# EasyEDA schematic PERSONCOUNTERWITHLED.json
TITLE: Sheet_1; REV: 1.0; Date: 2026-04-03; Sheet: 1/1; Company: Your Company
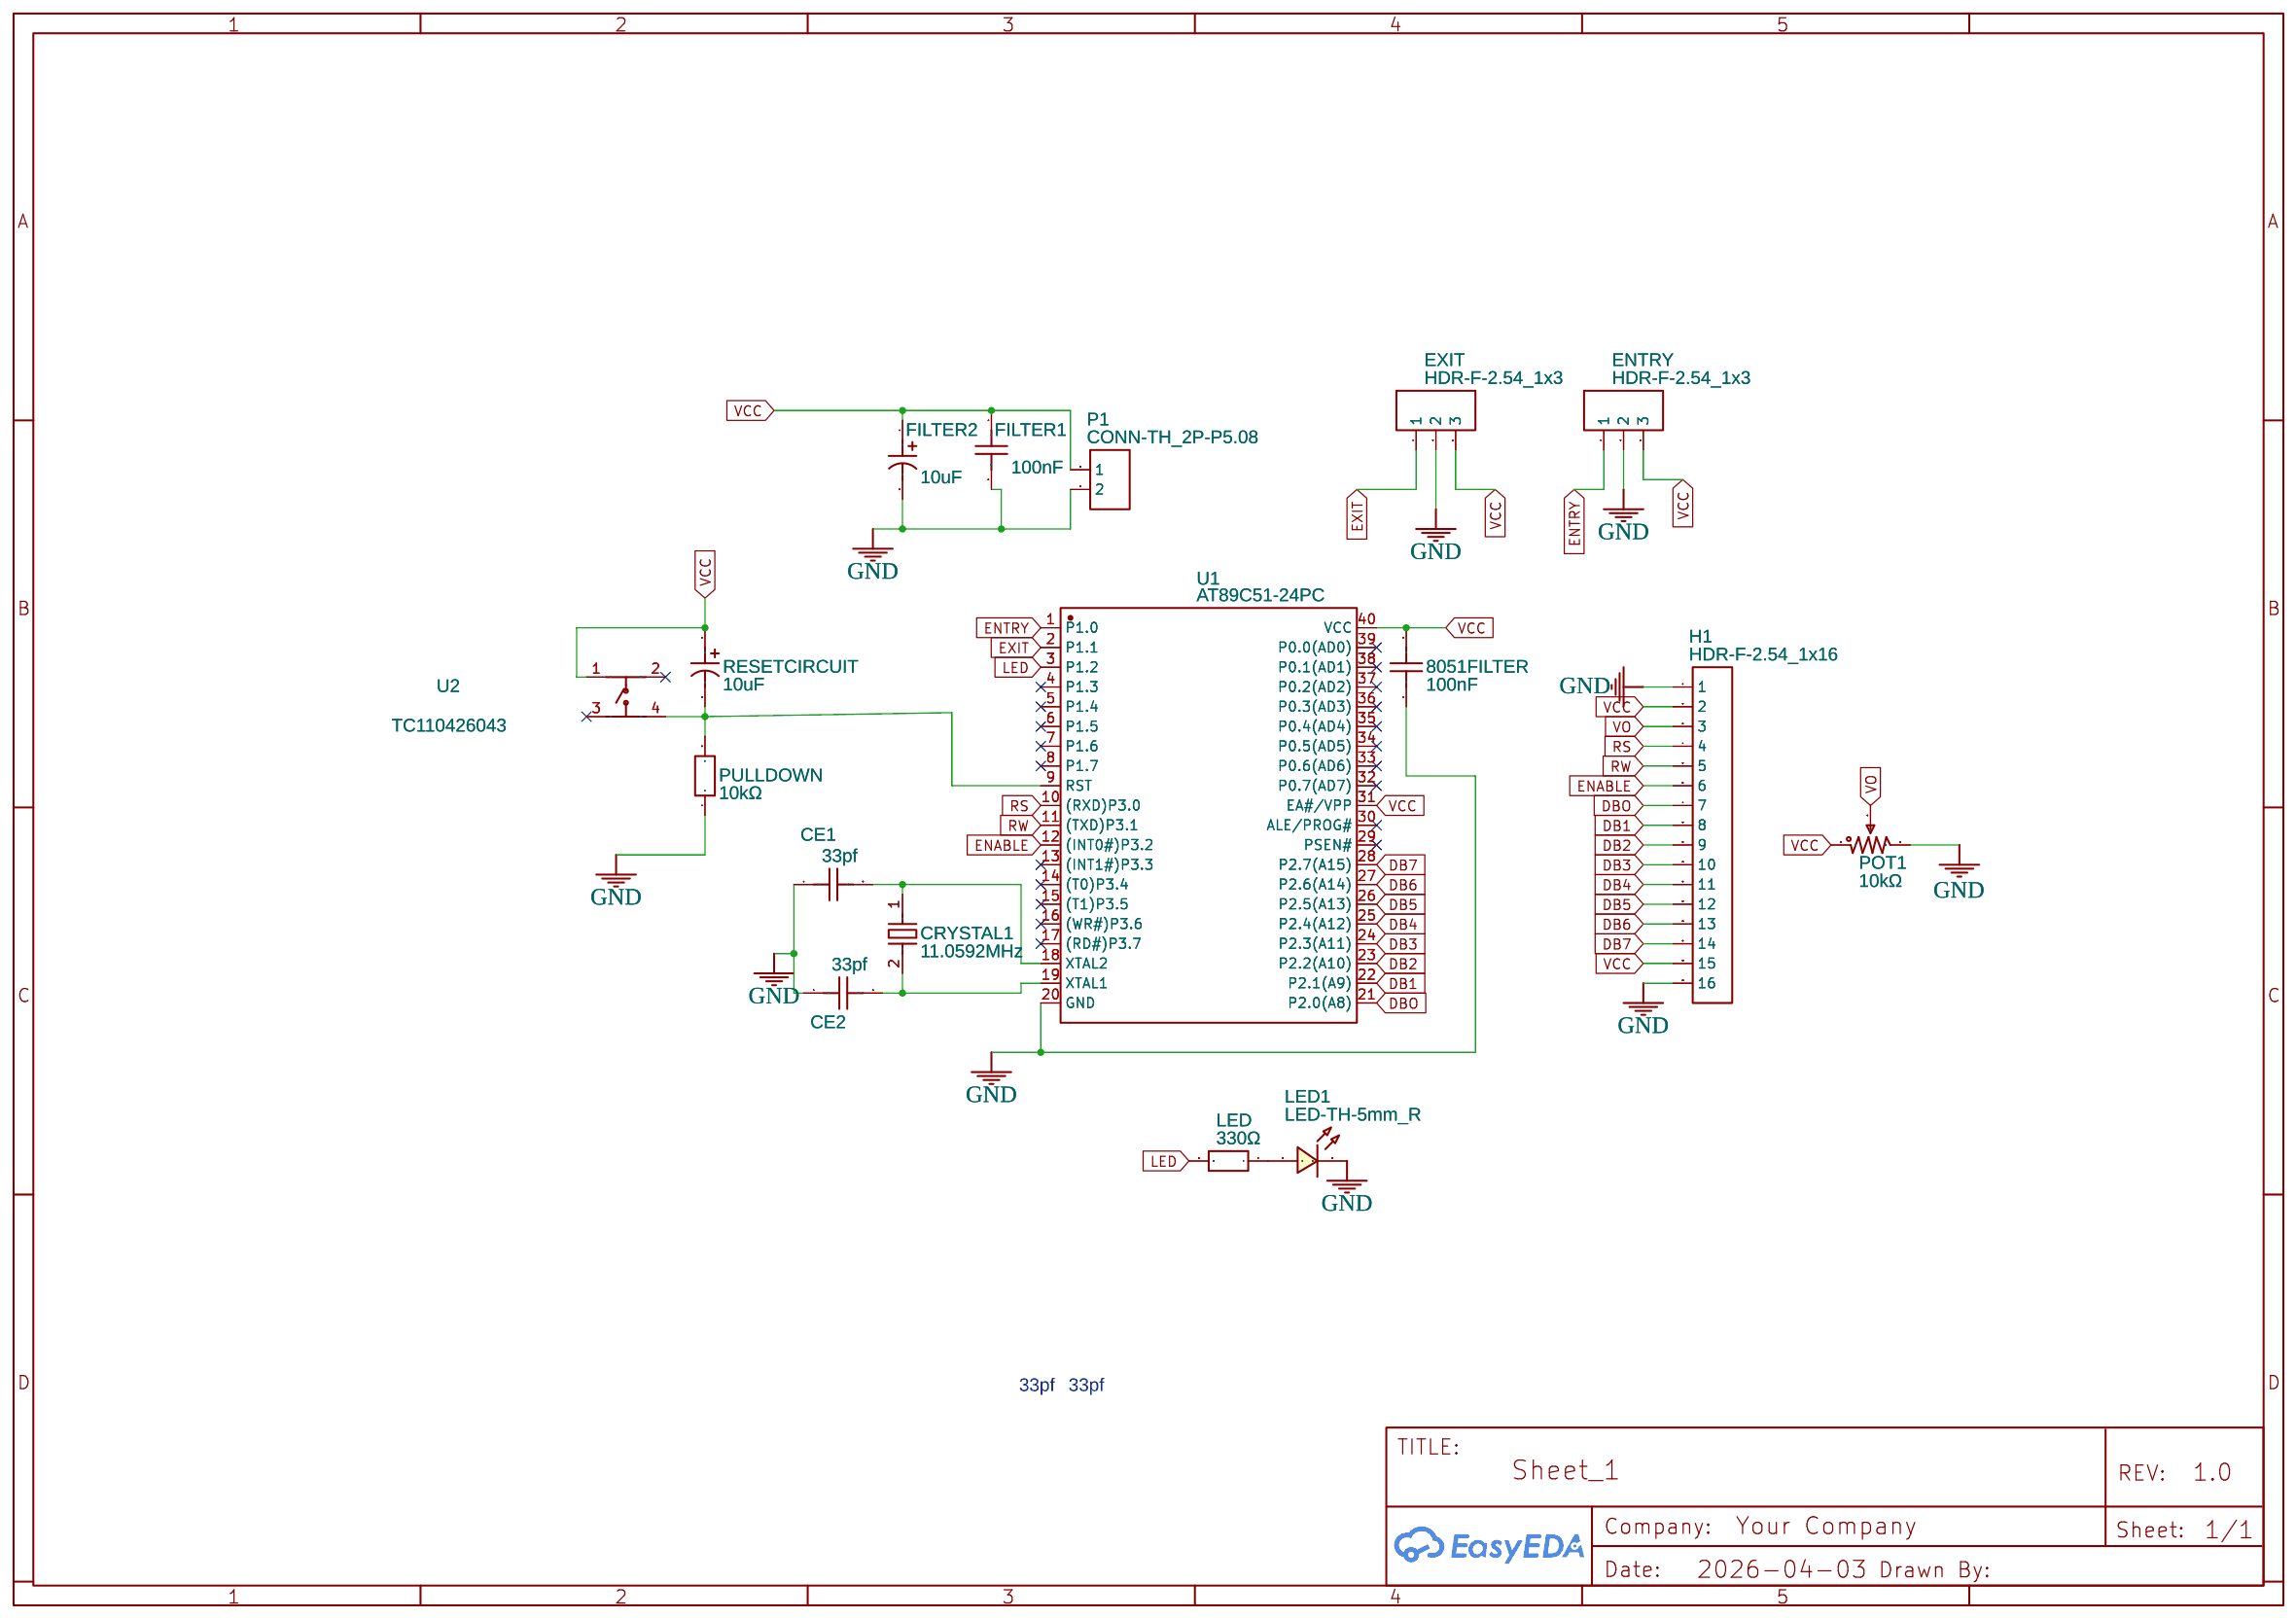
[diagram p0: schematic sheet]

## Parts
8051FILTER  100nF  [CAP-TH_L5.5-W2.0-P5.00-D1.0]
CE1  33pf  [CAP-TH_L5.5-W2.0-P5.00-D1.0]
CE2  33pf  [CAP-TH_L5.5-W2.0-P5.00-D1.0]
CRYSTAL1  11.0592MHz  [CRYSTAL-TH_L10.8-W4.5-P4.88]
ENTRY  HDR-F-2.54_1x3  [HDR-F-2.54_1X3]
EXIT  HDR-F-2.54_1x3  [HDR-F-2.54_1X3]
FILTER1  100nF  [CAP-TH_L5.5-W2.0-P5.00-D1.0]
FILTER2  10uF  [CAP-TH_BD5.0-P2.00-D0.8-FD-10UF50VC110GL]
H1  HDR-F-2.54_1x16  [HDR-F-2.54_1X16]
LED  330Ω  [RES-TH_BD2.2-L6.5-P10.50-D0.6]
LED1  LED-TH-5mm_R  [LED-TH_BD5.0_RED]
P1  CONN-TH_2P-P5.08  [CONN-TH_2P-P5.08]
POT1  10kΩ  [RES-ADJ-SMD_RM065-V1]
PULLDOWN  10kΩ  [RES-TH_BD2.2-L6.5-P10.50-D0.6]
RESETCIRCUIT  10uF  [CAP-TH_BD5.0-P2.00-D0.8-FD-10UF50VC110GL]
U1  AT89C51-24PC  [PDIP-40_L51.8-W13.5-P2.54-LS15.4-BL]
U2  TC110426043  [KEY-TH_4P-L6.0-W6.0-P4..5-LS6.5]

## Library data of the parts
8051FILTER CE1 CE2 FILTER1 = CC1H104ZC1PD3F5P3003: Contributor: LCSC; Supplier: LCSC; Supplier Part: C353904; Manufacturer: Dersonic(德尔创); JLCPCB Part Class: Extended Part
CRYSTAL1 = SP2011M05920001: Supplier: LCSC; Supplier Part: C7294716; Manufacturer: HUAXIN(华昕); Contributor: lcsc
ENTRY EXIT = HDR-F-2.54_1x3: Supplier Part: C146690; Supplier: LCSC; Contributor: LCEDA_Lib
FILTER2 RESETCIRCUIT = 10UF50VC110GL: Supplier: LCSC; Supplier Part: C46867109; Manufacturer: Econd(米朗电子); Contributor: lcsc; JLCPCB Part Class: Extended Part
H1 = HDR-F-2.54_1x16: Supplier Part: C66987; Supplier: LCSC; Contributor: LCEDA_Lib
LED PULLDOWN = MF006FF2202A50: Supplier: LCSC; Supplier Part: C18724236; Manufacturer: UNI-ROYAL(厚声); Contributor: lcsc; JLCPCB Part Class: Extended Part
LED1 = LED-TH-5mm_R: Manufacturer: EVERLIGHT(台湾亿光); Manufacturer Part: 333-2SURD/S530-A3; Supplier Part: C87271; Supplier: LCSC; Contributor: LCEDA_Lib
P1 = CONN-TH_2P-P5.08: Supplier: LCSC; Contributor: LCEDA_Lib
POT1 = RM065-103(10K): Supplier: LCSC; Supplier Part: C5205021; Manufacturer: BOCHEN(博晨); Contributor: lcsc; JLCPCB Part Class: Extended Part
U1 = AT89C51-24PC: Supplier: LCSC; Supplier Part: C6747247; Manufacturer: MICROCHIP(美国微芯); Contributor: lcsc; JLCPCB Part Class: Extended Part
U2 = TC110426043: Supplier: LCSC; Supplier Part: C22375329; Manufacturer: HanElectricity(瀚源); Contributor: lcsc; JLCPCB Part Class: Extended Part

## Nets
GND: 8051FILTER.2 CE1.1 CE2.1 ENTRY.2 EXIT.2 FILTER1.2 FILTER2.2 H1.1 H1.16 LED1.2 P1.2 POT1.3 PULLDOWN.1 U1.20(GND)
VCC: 8051FILTER.1 ENTRY.3 EXIT.3 FILTER1.1 FILTER2.1 H1.2 H1.15 P1.1 POT1.1 RESETCIRCUIT.1 U1.31(EA#/VPP) U1.40(VCC) U2.1
DB1: H1.8 U1.22(P2.1(A9))
DB2: H1.9 U1.23(P2.2(A10))
DB3: H1.10 U1.24(P2.3(A11))
DB4: H1.11 U1.25(P2.4(A12))
DB5: H1.12 U1.26(P2.5(A13))
DB6: H1.13 U1.27(P2.6(A14))
DB7: H1.14 U1.28(P2.7(A15))
DBO: H1.7 U1.21(P2.0(A8))
ENABLE: H1.6 U1.12((INT0#)P3.2)
ENTRY: ENTRY.1 U1.1(P1.0)
EXIT: EXIT.1 U1.2(P1.1)
LED: LED.2 U1.3(P1.2)
RS: H1.4 U1.10((RXD)P3.0)
RW: H1.5 U1.11((TXD)P3.1)
VO: H1.3 POT1.2
Net-(CE1-2): CE1.2 CRYSTAL1.1 U1.18(XTAL2)
Net-(CE2-2): CE2.2 CRYSTAL1.2 U1.19(XTAL1)
Net-(LED-1): LED.1 LED1.1
Net-(PULLDOWN-2): PULLDOWN.2 RESETCIRCUIT.2 U1.9(RST) U2.4

Not connected (* = marked no-connect by the designer): U1 4(P1.3)* 5(P1.4)* 6(P1.5)* 7(P1.6)* 8(P1.7)* 13((INT1#)P3.3)* 14((T0)P3.4)* 15((T1)P3.5)* 16((WR#)P3.6)* 17((RD#)P3.7)* 29(PSEN#)* 30(ALE/PROG#)* 32(P0.7(AD7))* 33(P0.6(AD6))* 34(P0.5(AD5))* 35(P0.4(AD4))* 36(P0.3(AD3))* 37(P0.2(AD2))* 38(P0.1(AD1))* 39(P0.0(AD0))*; U2 2* 3*

## Notes on the sheet
- 33pf
- 33pf
